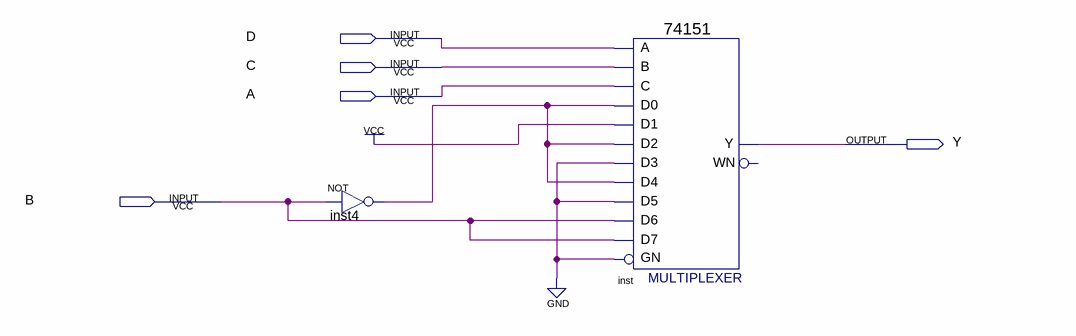
[diagram p0: schematic sheet]
// Quartus schematic en.bdf as structural Verilog: 2 symbols, 5 pins
module en (
  input  D,
  input  C,
  input  A,
  input  B,
  output Y
);

  wire inst4_out;

  not inst4 (inst4_out, B);
  \74151  inst (
    .GN(1'b0), .C(A), .B(C), .A(D), .D5(1'b0), .D0(inst4_out), .D1(1'b1), .D4(inst4_out), .D3(1'b0),
    .D2(inst4_out), .D6(B), .D7(B), .Y(Y));  // open: WN
endmodule
